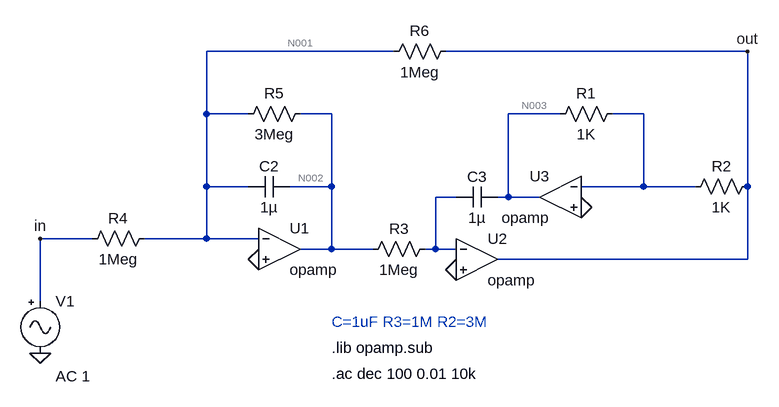
[diagram p0: schematic TS2.asc]
TS2.asc, the LTspice schematic file:
Version 4
SHEET 1 880 680
WIRE 224 -160 -64 -160
WIRE 768 -160 304 -160
WIRE -64 -64 -64 -160
WIRE 0 -64 -64 -64
WIRE 128 -64 80 -64
WIRE 480 -64 400 -64
WIRE 608 -64 560 -64
WIRE -64 48 -64 -64
WIRE 0 48 -64 48
WIRE 128 48 128 -64
WIRE 128 48 64 48
WIRE 608 48 608 -64
WIRE 608 48 512 48
WIRE 688 48 608 48
WIRE 768 48 768 -160
WIRE 320 64 288 64
WIRE 400 64 400 -64
WIRE 400 64 384 64
WIRE 448 64 400 64
WIRE -240 128 -320 128
WIRE -64 128 -64 48
WIRE -64 128 -160 128
WIRE 16 128 -64 128
WIRE 128 144 128 48
WIRE 128 144 80 144
WIRE 192 144 128 144
WIRE 288 144 288 64
WIRE 288 144 272 144
WIRE 320 144 288 144
WIRE 768 160 768 48
WIRE 768 160 384 160
WIRE -320 224 -320 128
FLAG 320 176 0
FLAG 16 160 0
FLAG 512 80 0
FLAG -320 304 0
FLAG -320 128 in
FLAG 768 -160 out
SYMBOL OpAmps\\opamp 48 80 R0
SYMATTR InstName U1
SYMBOL OpAmps\\opamp 352 96 R0
SYMATTR InstName U2
SYMBOL OpAmps\\opamp 480 0 M0
SYMATTR InstName U3
SYMBOL res 576 -80 R90
WINDOW 0 0 56 VBottom 2
WINDOW 3 32 56 VTop 2
SYMATTR InstName R1
SYMATTR Value 1K
SYMBOL res 784 32 R90
WINDOW 0 0 56 VBottom 2
WINDOW 3 32 56 VTop 2
SYMATTR InstName R2
SYMATTR Value 1K
SYMBOL res 288 128 R90
WINDOW 0 0 56 VBottom 2
WINDOW 3 32 56 VTop 2
SYMATTR InstName R3
SYMATTR Value 1Meg
SYMBOL cap 64 32 R90
WINDOW 0 0 32 VBottom 2
WINDOW 3 32 32 VTop 2
SYMATTR InstName C2
SYMATTR Value 1µ
SYMBOL cap 384 48 R90
WINDOW 0 0 32 VBottom 2
WINDOW 3 32 32 VTop 2
SYMATTR InstName C3
SYMATTR Value 1µ
SYMBOL res -144 112 R90
WINDOW 0 0 56 VBottom 2
WINDOW 3 32 56 VTop 2
SYMATTR InstName R4
SYMATTR Value 1Meg
SYMBOL res 96 -80 R90
WINDOW 0 0 56 VBottom 2
WINDOW 3 32 56 VTop 2
SYMATTR InstName R5
SYMATTR Value 3Meg
SYMBOL Misc\\signal -320 208 R0
WINDOW 123 24 132 Left 2
WINDOW 39 0 0 Left 0
SYMATTR Value2 AC 1
SYMATTR InstName V1
SYMATTR Value ""
SYMBOL res 320 -176 R90
WINDOW 0 0 56 VBottom 2
WINDOW 3 32 56 VTop 2
SYMATTR InstName R6
SYMATTR Value 1Meg
TEXT 128 336 Left 2 !.ac dec 100 0.01 10k
TEXT 128 296 Left 2 !.lib opamp.sub
TEXT 128 256 Left 2 ;C=1uF R3=1M R2=3M

The netlist it stands for:
* TS2.asc
XU1 N001 0 N002 opamp Aol=100K GBW=10Meg  ; pins invin noninvin out
XU2 N005 0 out opamp Aol=100K GBW=10Meg  ; pins invin noninvin out
XU3 N004 0 N003 opamp Aol=100K GBW=10Meg  ; pins invin noninvin out
R1 N004 N003 1K
R2 out N004 1K
R3 N005 N002 1Meg
C2 N002 N001 1µ
C3 N003 N005 1µ
R4 N001 in 1Meg
R5 N002 N001 3Meg
V1 in 0 AC 1
R6 out N001 1Meg
.ac dec 100 0.01 10k
.lib opamp.sub
* C=1uF R3=1M R2=3M
.backanno
.end

* Results of the author's LTspice run, read from the files saved beside the schematic
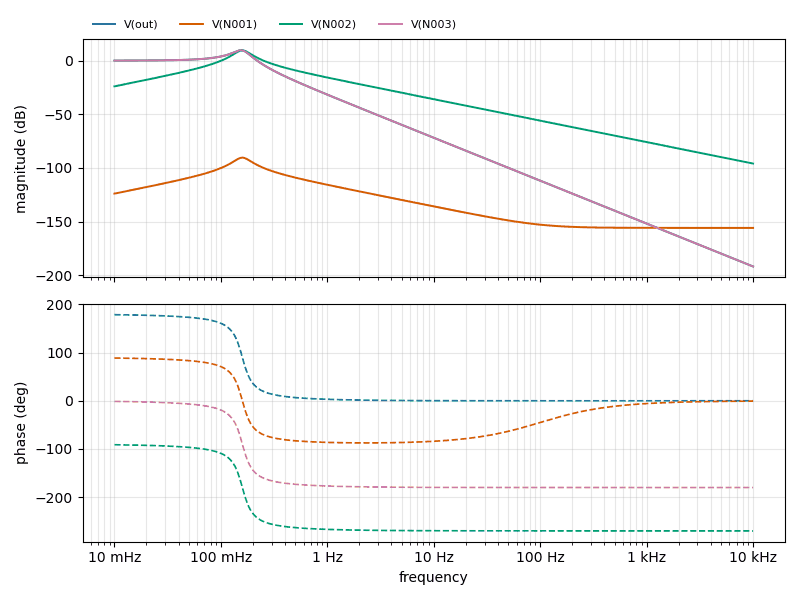
[diagram p1: AC Analysis of TS2.asc, plotted from the saved traces]
* AC Analysis, 1 run:
*   V(out): 0.03 dB at 10 mHz, -191.93 dB at 10 kHz, peak 9.66 dB at 154.9 mHz, 3 dB below the peak at 124.9 mHz and 179.6 mHz
*   V(N001): -124.00 dB at 10 mHz, -155.96 dB at 10 kHz, peak -90.46 dB at 158.5 mHz, 3 dB below the peak at 134.8 mHz and 187.9 mHz
*   V(N002): -24.00 dB at 10 mHz, -95.96 dB at 10 kHz, peak 9.54 dB at 158.5 mHz, 3 dB below the peak at 134.8 mHz and 187.9 mHz
*   V(N003): 0.03 dB at 10 mHz, -191.93 dB at 10 kHz, peak 9.66 dB at 154.9 mHz, 3 dB below the peak at 124.9 mHz and 179.6 mHz